# EAGLE schematic Esquema_general (EAGLE 9.1.3)
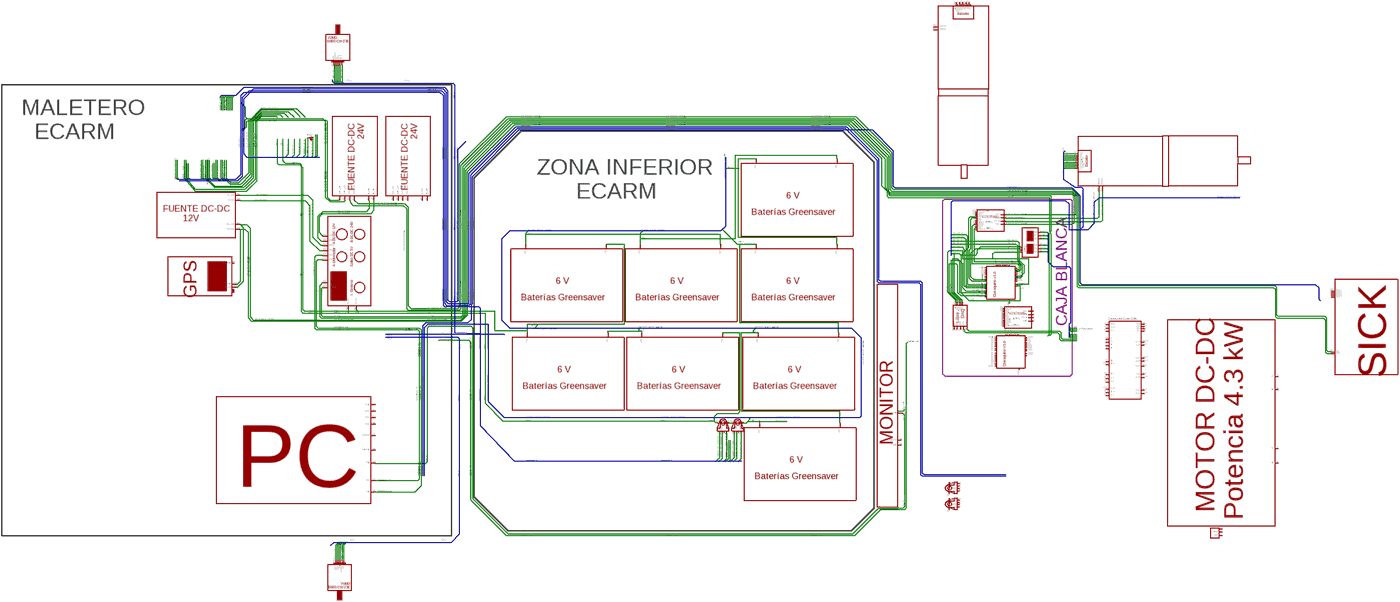
[diagram p0: schematic, sheet 1, overview]
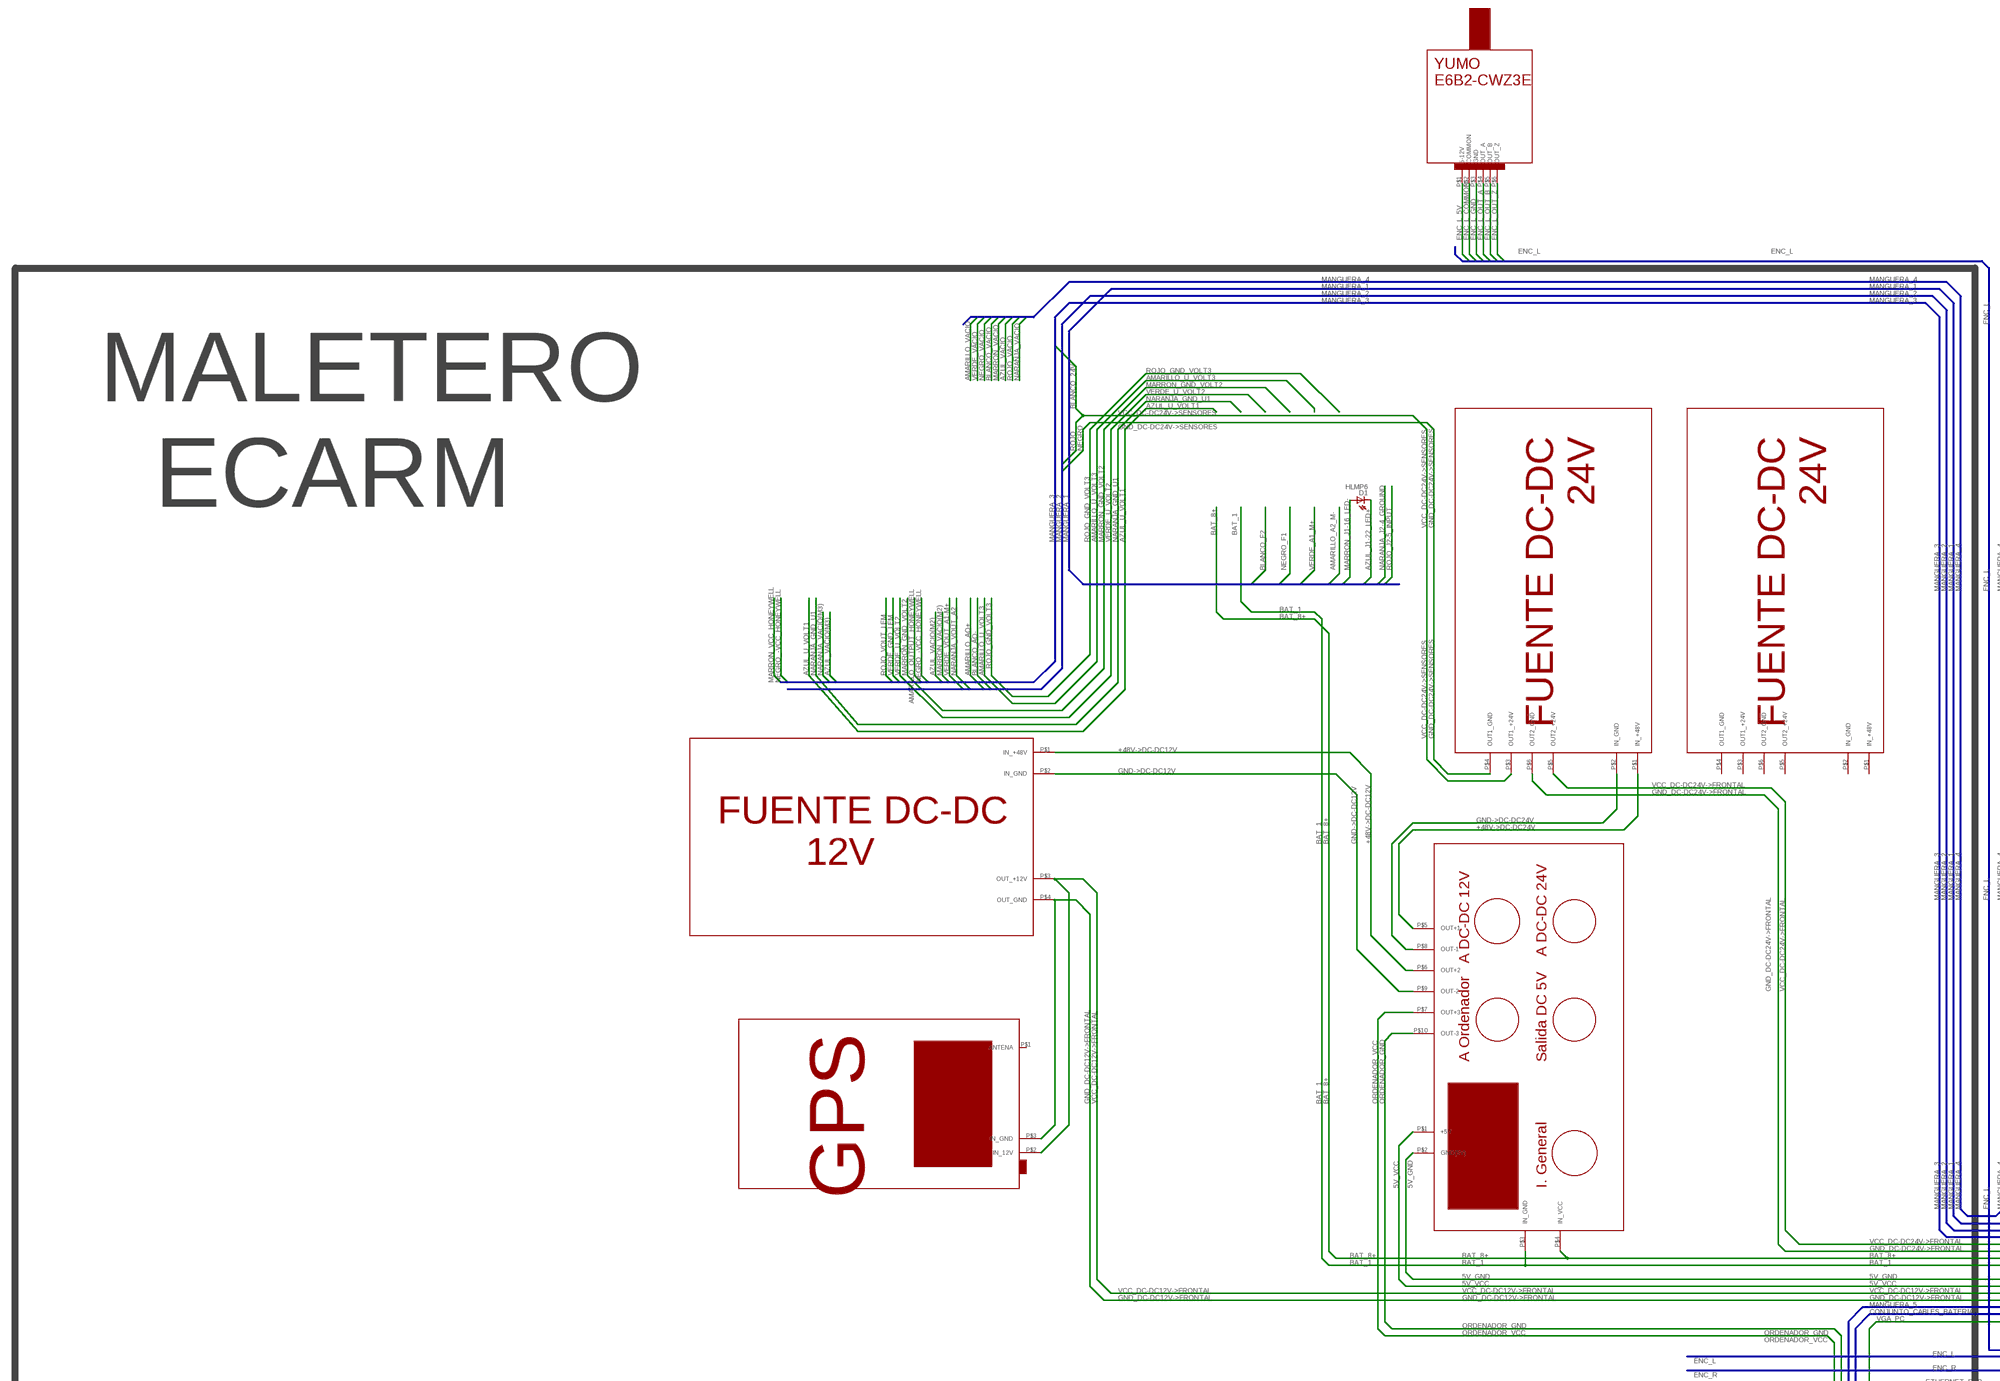
[diagram p1: schematic, sheet 1, part 1 of 6]
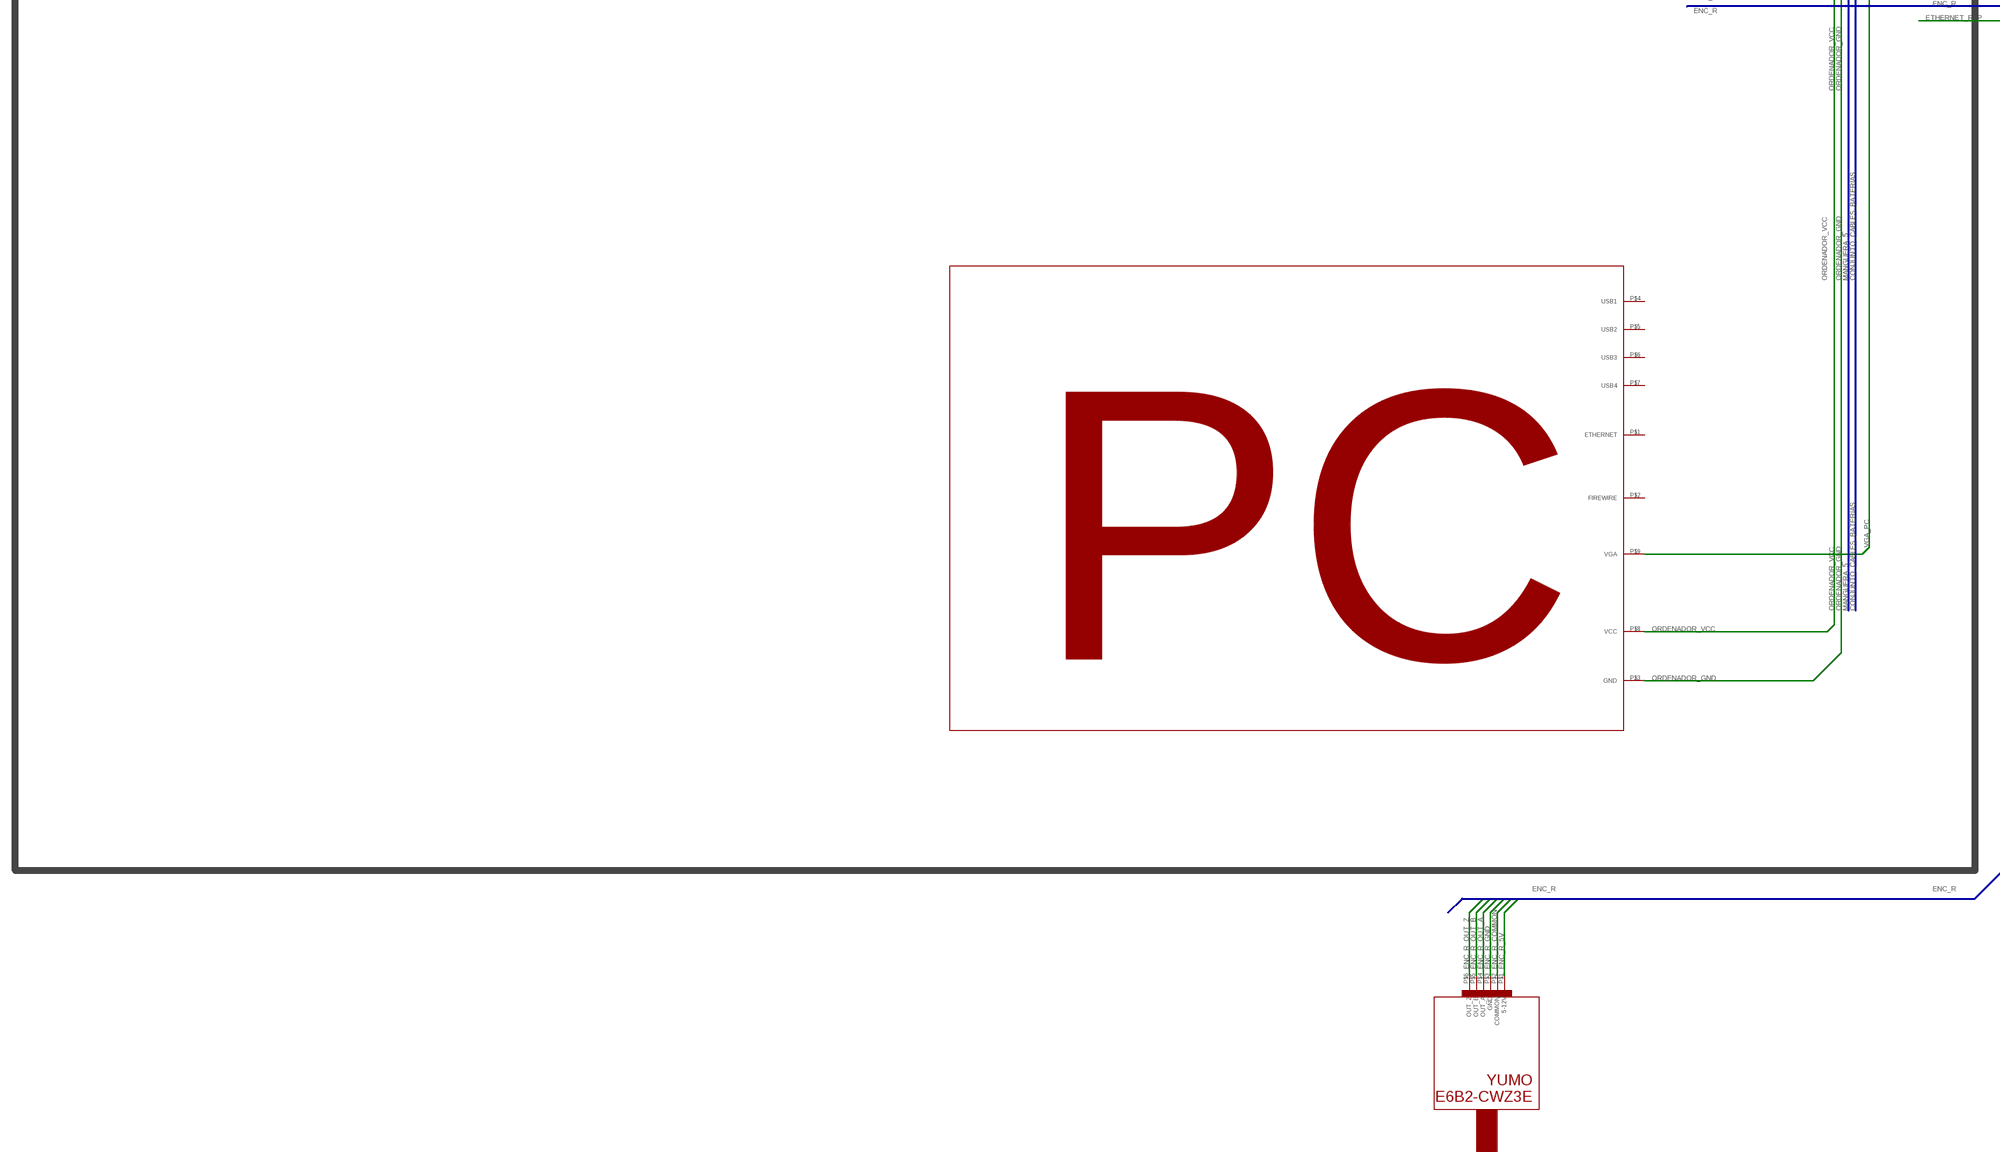
[diagram p2: schematic, sheet 1, part 2 of 6]
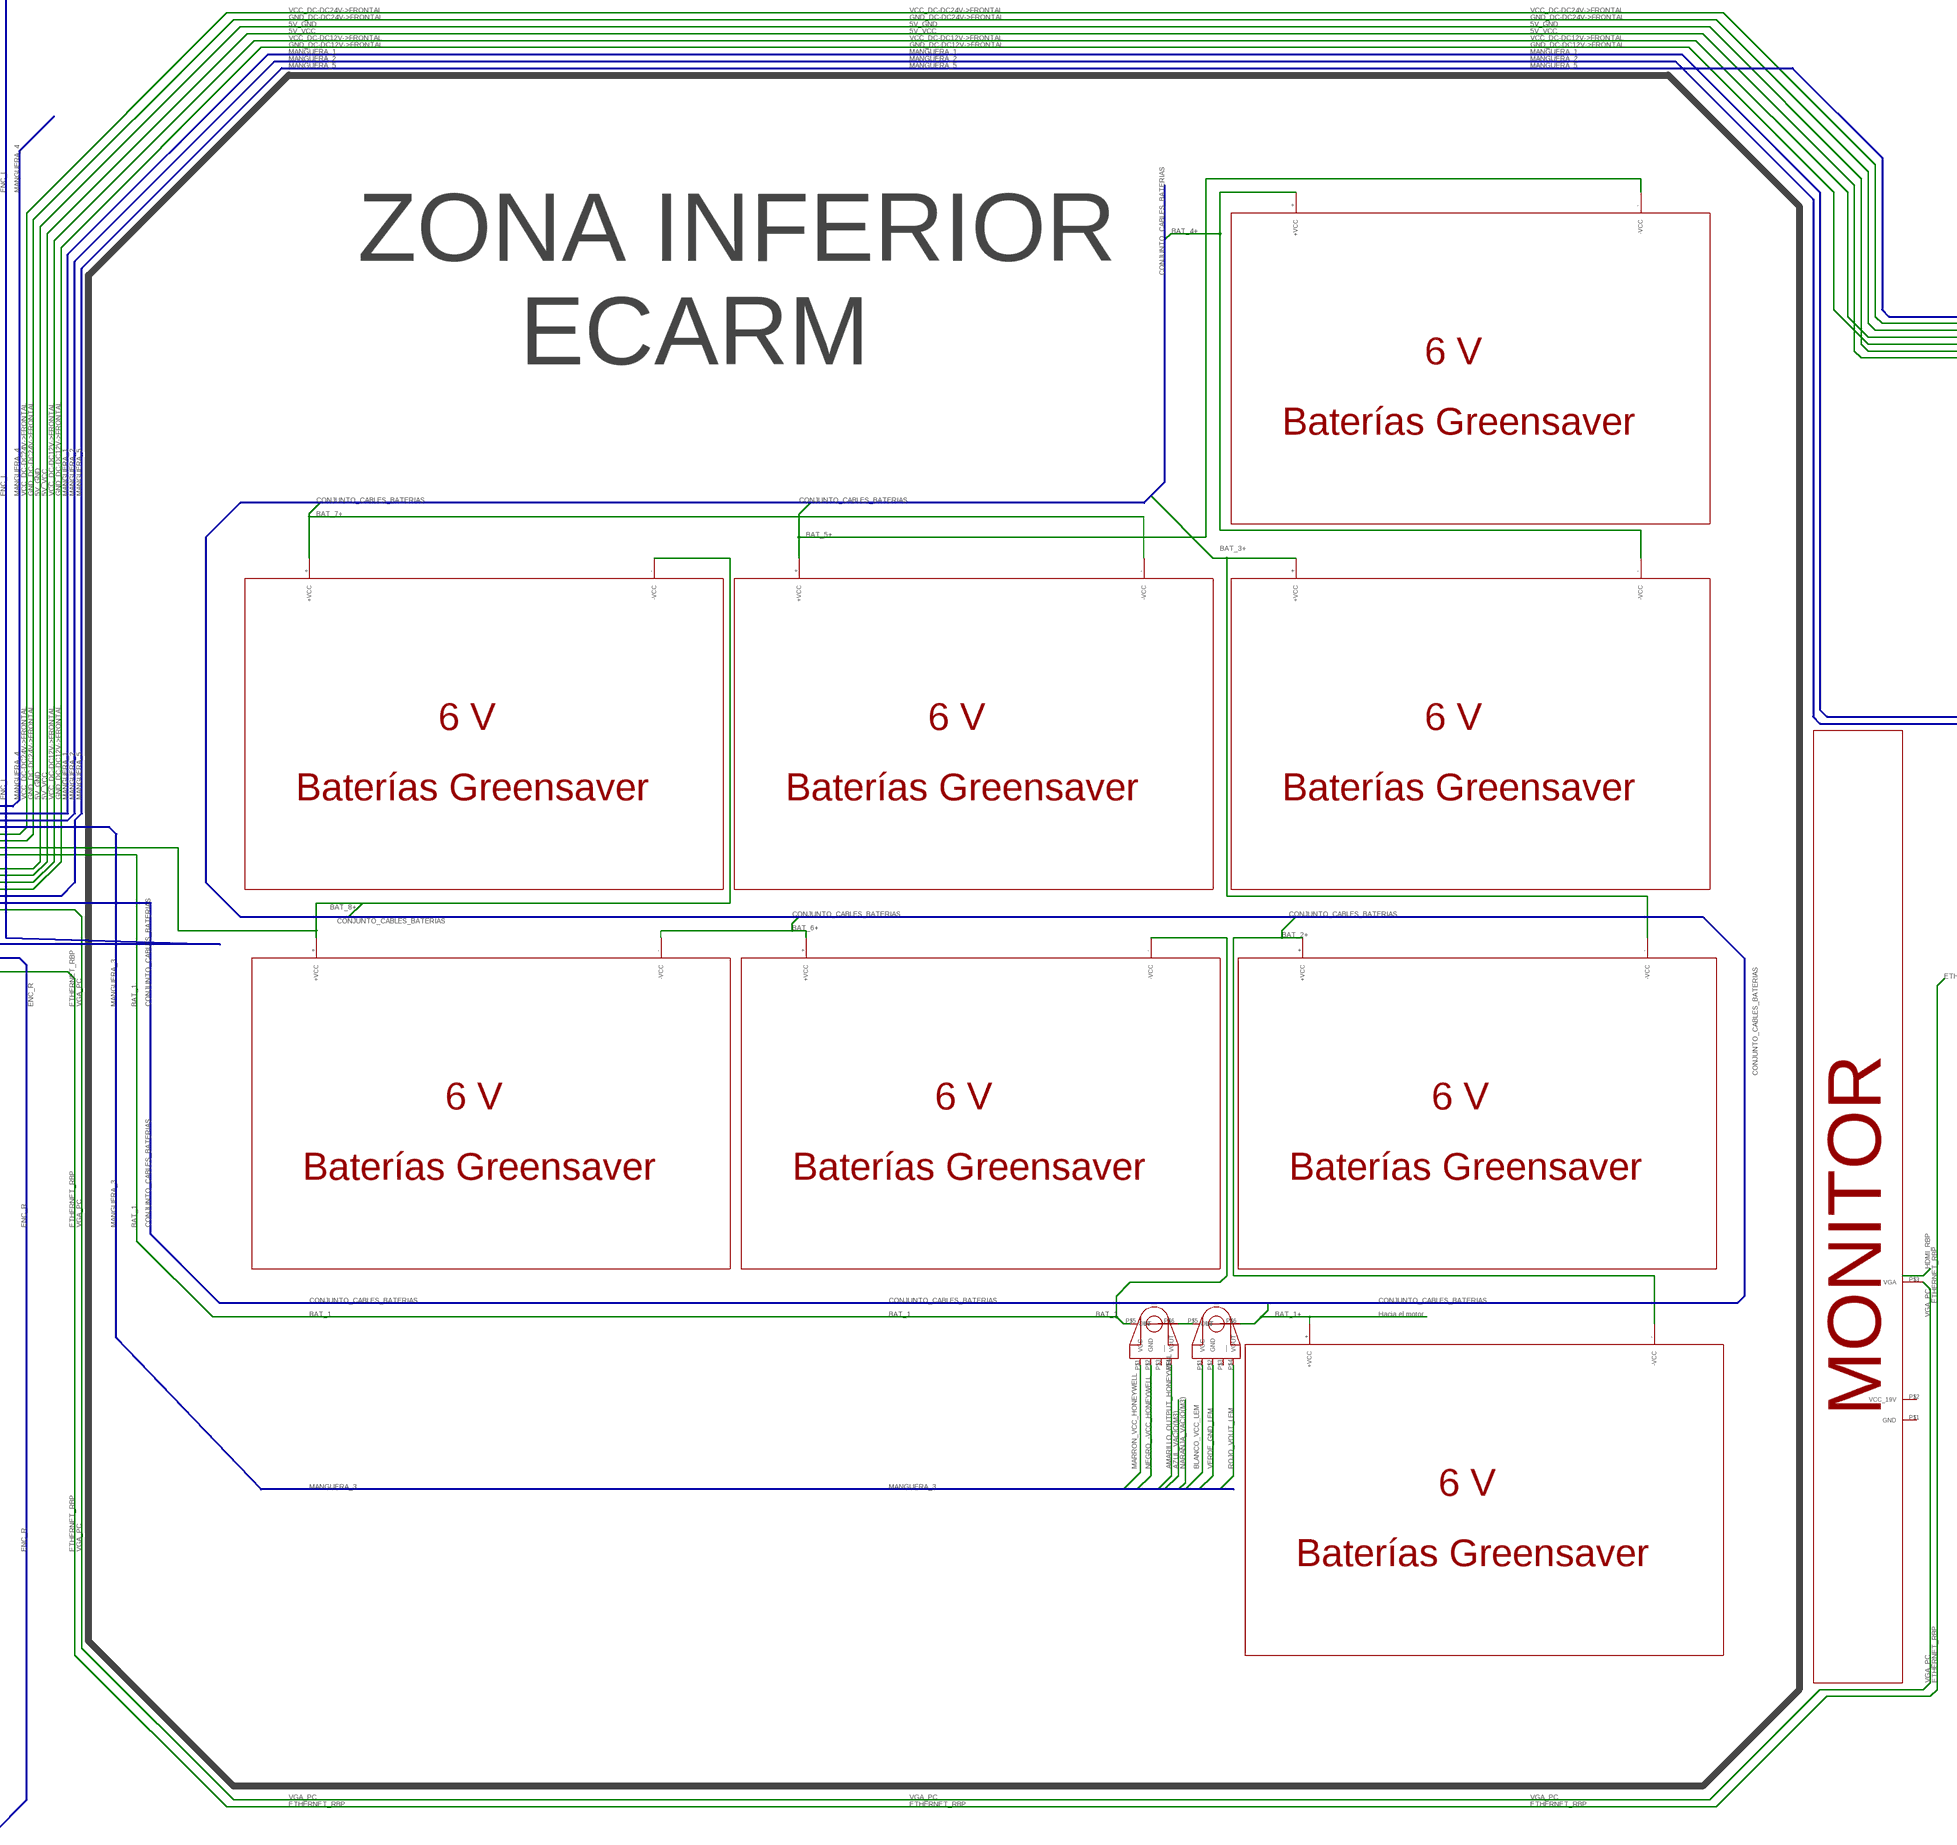
[diagram p3: schematic, sheet 1, part 3 of 6]
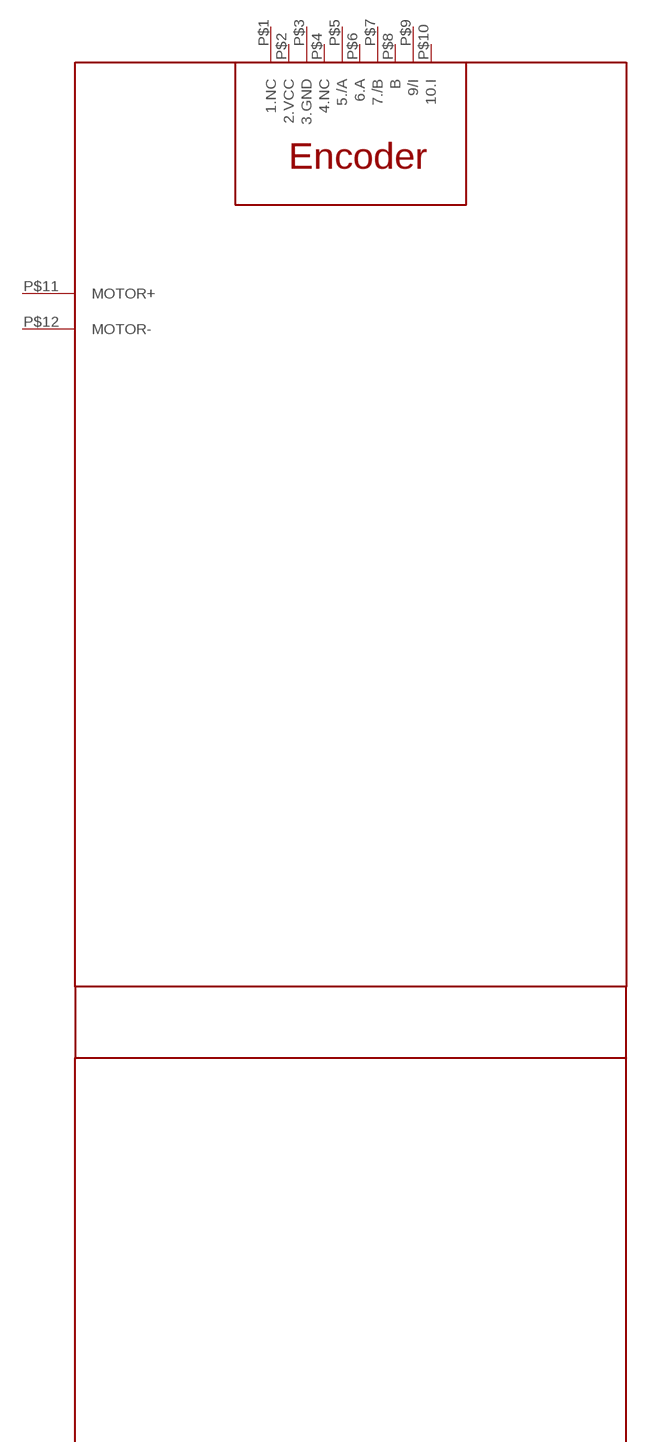
[diagram p4: schematic, sheet 1, part 4 of 6]
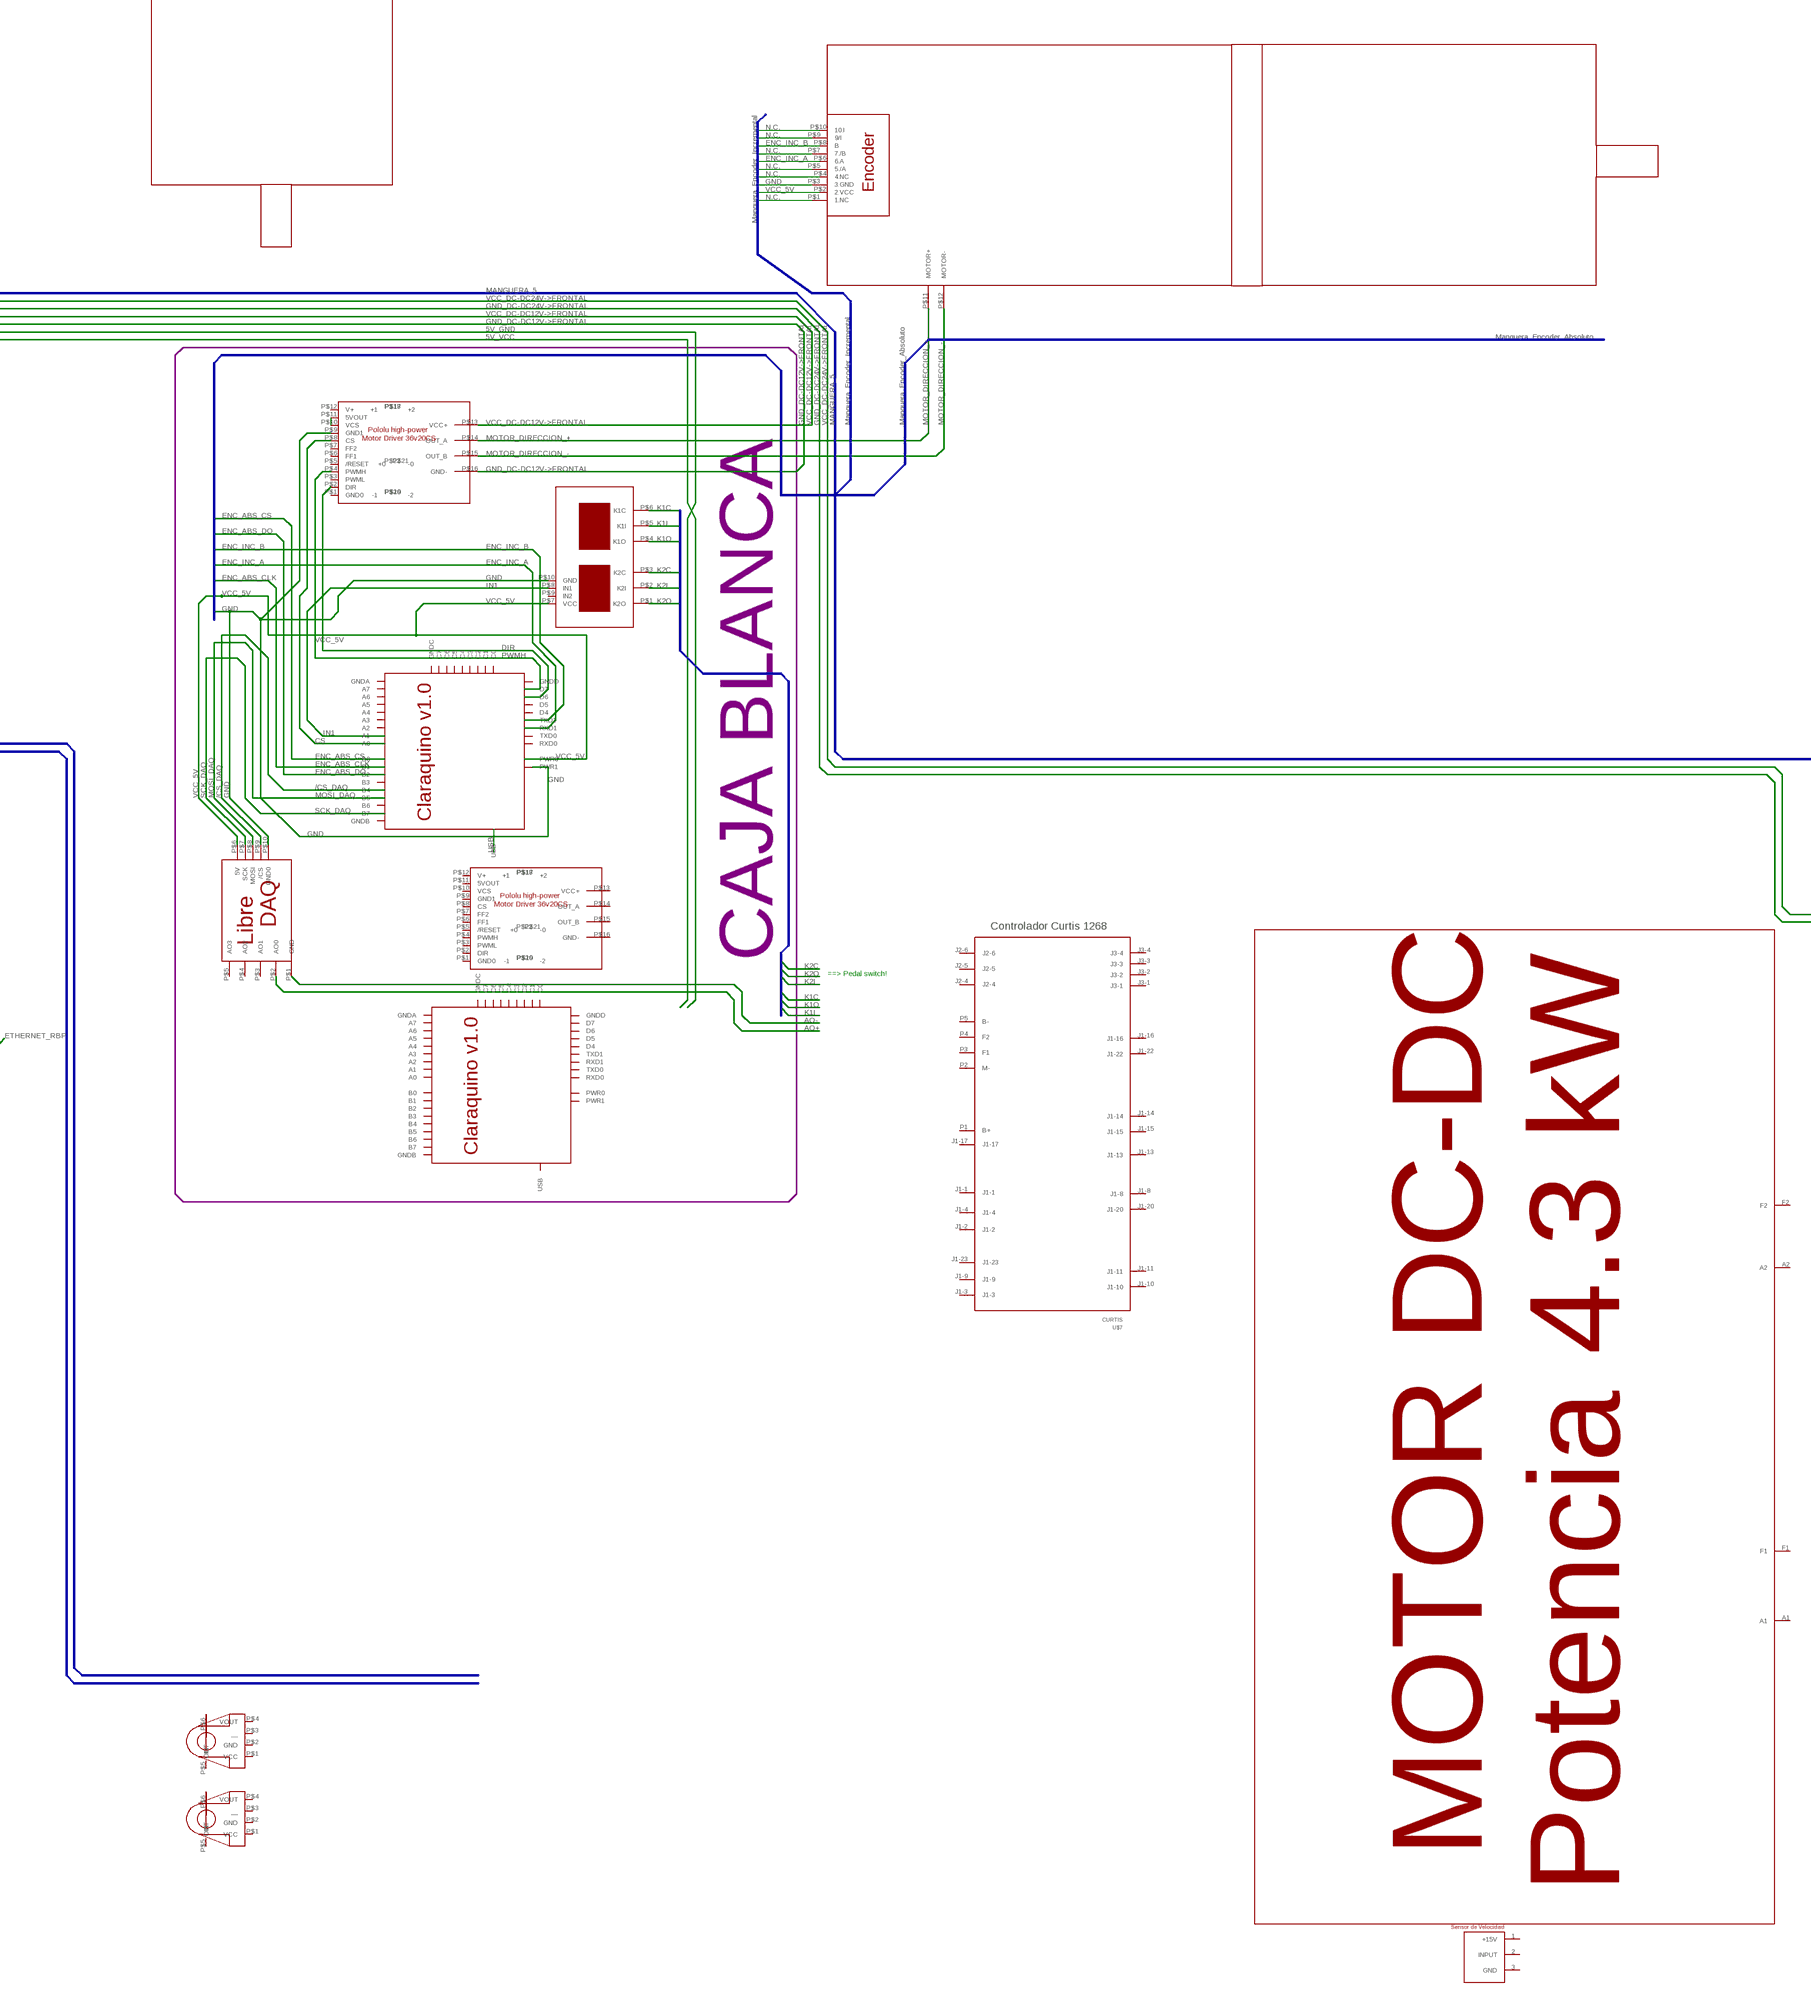
[diagram p5: schematic, sheet 1, part 5 of 6]
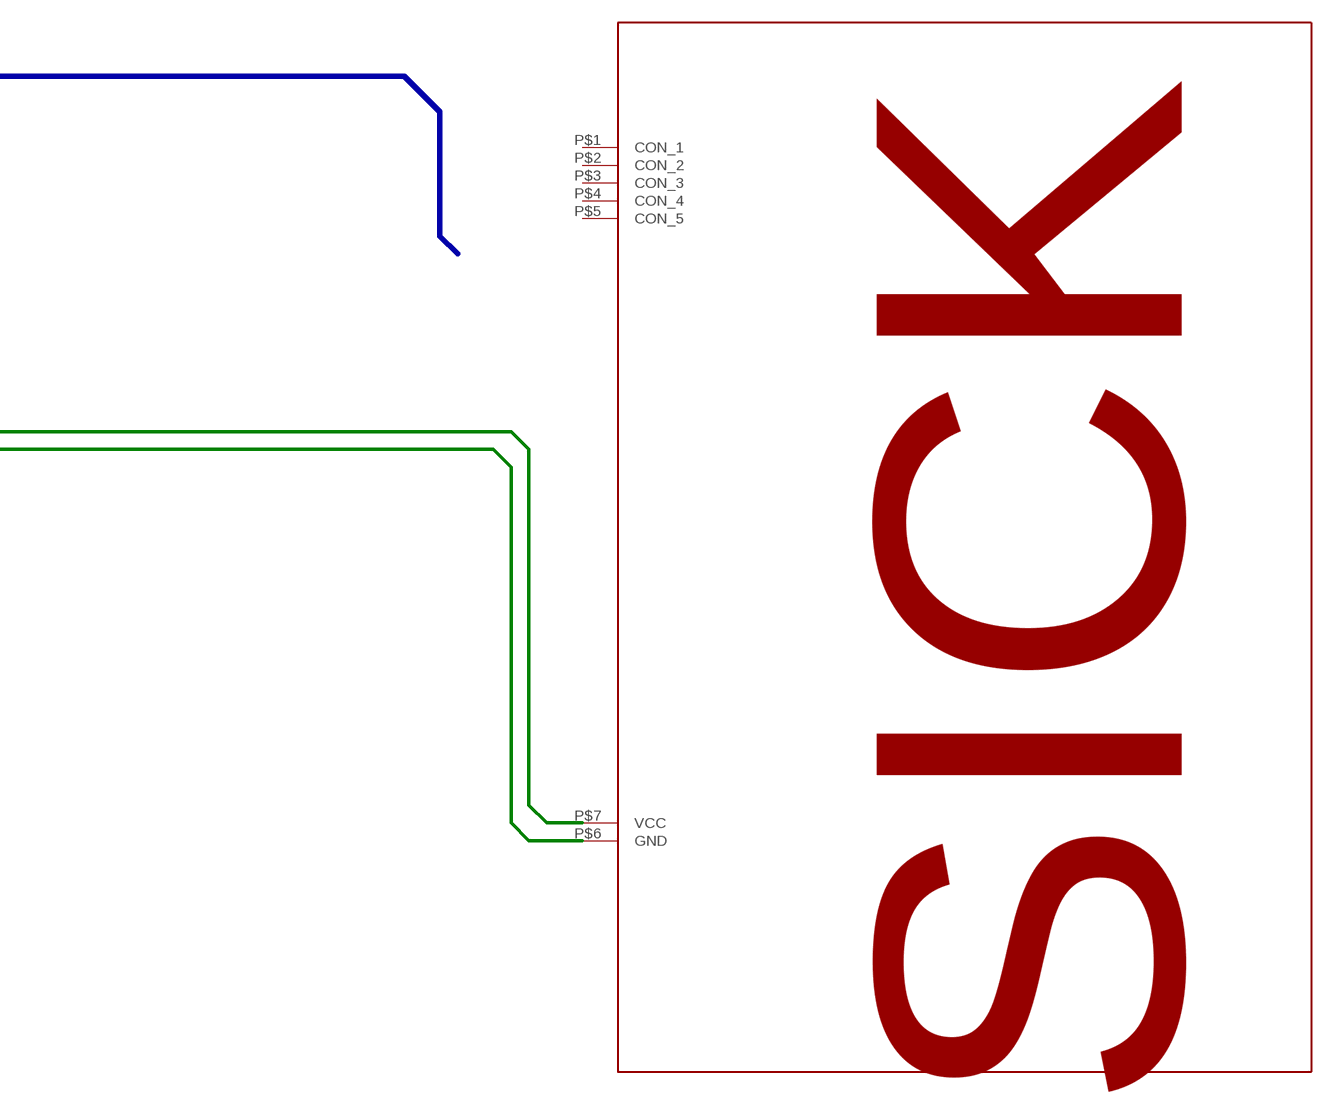
[diagram p6: schematic, sheet 1, part 6 of 6]

## Parts
D1  HLMP6  [HLMP6]
U$1  CLARAQUINO_V1.0  (no package)
U$2  FUENTE_24V  [FUENTE_24V]
U$3  SENSOR_VELOCIDAD  [SENSOR_VEL]
U$7  CURTIS  [CURTIS]
U$8  BATERIA  [BATERIA]
U$9  BATERIA  [BATERIA]
U$10  BATERIA  [BATERIA]
U$11  BATERIA  [BATERIA]
U$12  BATERIA  [BATERIA]
U$13  BATERIA  [BATERIA]
U$14  BATERIA  [BATERIA]
U$15  BATERIA  [BATERIA]
U$16  PC  [PC]
U$17  GPS  [GPS]
U$18  AMPERIMETRO  [AMPERIMETRO]
U$19  AMPERIMETRO  [AMPERIMETRO]
U$20  AMPERIMETRO  [AMPERIMETRO]
U$21  POWERBOX  [POWERBOX]
U$22  FUENTE_12V  [FUENTE_12V]
U$23  FUENTE_24V  [FUENTE_24V]
U$24  CLARAQUINO_V1.0  (no package)
U$26  ENCODER_YUMO  [ENCODER]
U$27  ENCODER_YUMO  [ENCODER]
U$28  MONITOR  [MONITOR]
U$29  SICK  [SICK]
U$30  MOTOR_SENSORES  [MOTOR_SENSORES]
U$31  MOTOR_DIRECCION  [MOTOR_DIRECCION]
U$32  RELE_ARDUINO  [RELE_ARDUINO]
U$33  POLOLU_HIGH-POWER_MOTOR_DRIVER  [POLOLU_HIGH-POWER_MOTOR]
U$34  POLOLU_HIGH-POWER_MOTOR_DRIVER  [POLOLU_HIGH-POWER_MOTOR]
U$35  AMPERIMETRO  [AMPERIMETRO]
U$36  LIBRE_DAQ  [LIBRE_DAQ]
U$37  MOTOR_DIRECCION  [MOTOR_DIRECCION]

## Nets
5V_GND: U$21.P$2(GND(5V))
5V_VCC: U$21.P$1(+5V)
+48V->DC-DC12V: U$21.P$6(OUT+2) U$22.P$1(IN_+48V)
+48V->DC-DC24V: U$21.P$5(OUT+1) U$23.P$1(IN_+48V)
/CS_DAQ: U$24.B4 U$36.P$9(/CS)
AMARILLO_OUTPUT_HONEYWELL: U$35.P$4(VOUT)
AO+: U$36.P$2(AO0)
AO-: U$36.P$1(GND)
AZUL_J1-22_LED+: D1.K
BAT_1: U$9.-(-VCC) U$21.P$3(IN_GND) U$35.P$5(IN)
BAT_1+: U$11.+(+VCC) U$20.P$6(OUT)
BAT_2+: U$10.+(+VCC) U$11.-(-VCC)
BAT_3+: U$10.-(-VCC) U$13.+(+VCC)
BAT_4+: U$13.-(-VCC) U$15.+(+VCC)
BAT_5+: U$8.+(+VCC) U$15.-(-VCC)
BAT_6+: U$9.+(+VCC) U$12.-(-VCC)
BAT_7+: U$8.-(-VCC) U$14.+(+VCC)
BAT_8+: U$12.+(+VCC) U$14.-(-VCC) U$21.P$4(IN_VCC)
BLANCO_VCC_LEM: U$20.P$1(VCC)
CS: U$24.A0 U$34.P$8(CS)
DIR: U$24.D6 U$34.P$2(DIR)
ENC_ABS_CLK: U$24.B1
ENC_ABS_CS: U$24.B0
ENC_ABS_DO: U$24.B2
ENC_INC_A: U$24.RXD1 U$37.P$6(6.A)
ENC_INC_B: U$24.TXD1 U$37.P$8(B)
ENC_L_5V: U$26.P$1(5-12V)
ENC_L_COMMON: U$26.P$2(COMMON)
ENC_L_GND: U$26.P$3(GND)
ENC_L_OUT_A: U$26.P$4(OUT_A)
ENC_L_OUT_B: U$26.P$5(OUT_B)
ENC_L_OUT_Z: U$26.P$6(OUT_Z)
ENC_R_5V: U$27.P$1(5-12V)
ENC_R_COMMON: U$27.P$2(COMMON)
ENC_R_GND: U$27.P$3(GND)
ENC_R_OUT_A: U$27.P$4(OUT_A)
ENC_R_OUT_B: U$27.P$5(OUT_B)
ENC_R_OUT_Z: U$27.P$6(OUT_Z)
GND: U$32.P$10(GND) U$34.P$9(GND1) U$36.P$10(GND0) U$37.P$3(3.GND)
GND->DC-DC12V: U$21.P$9(OUT-2) U$22.P$2(IN_GND)
GND->DC-DC24V: U$21.P$8(OUT-1) U$23.P$2(IN_GND)
GND_DC-DC12V->FRONTAL: U$17.P$3(IN_GND) U$22.P$4(OUT_GND) U$34.P$16(GND-)
GND_DC-DC24V->FRONTAL: U$23.P$6(OUT2_GND) U$29.P$6(GND)
GND_DC-DC24V->SENSORES: U$23.P$4(OUT1_GND)
IN1: U$24.A1 U$32.P$8(IN1)
K1C: U$32.P$6(K1C)
K1I: U$32.P$5(K1I)
K1O: U$32.P$4(K1O)
K2C: U$32.P$3(K2C)
K2I: U$32.P$2(K2I)
K2O: U$32.P$1(K2O)
MARRON_J1-16_LED-: D1.A
MARRON_VCC_HONEYWELL: U$35.P$1(VCC)
MOSI_DAQ: U$24.B5 U$36.P$8(MOSI)
MOTOR_DIRECCION_+: U$34.P$14(OUT_A) U$37.P$11(MOTOR+)
MOTOR_DIRECCION_-: U$34.P$15(OUT_B) U$37.P$12(MOTOR-)
N$2: U$20.P$5(IN) U$35.P$6(OUT)
N$3: U$34.P$10(VCS) U$34.P$11(5VOUT)
N.C.: U$37.P$1(1.NC) U$37.P$4(4.NC) U$37.P$5(5./A) U$37.P$7(7./B) U$37.P$9(9/I) U$37.P$10(10.I)
NEGRO_-VCC_HONEYWELL: U$35.P$2(GND)
ORDENADOR_GND: U$16.P$3(GND) U$21.P$10(OUT-3)
ORDENADOR_VCC: U$16.P$8(VCC) U$21.P$7(OUT+3)
PWMH: U$24.D7 U$34.P$4(PWMH)
ROJO_VOUT_LEM: U$20.P$4(VOUT)
SCK_DAQ: U$24.B7 U$36.P$7(SCK)
USB: U$24.USB
VCC_5V: U$24.PWR0 U$32.P$7(VCC) U$36.P$6(5V) U$37.P$2(2.VCC)
VCC_DC-DC12V->FRONTAL: U$17.P$2(IN_12V) U$22.P$3(OUT_+12V) U$34.P$13(VCC+)
VCC_DC-DC24V->FRONTAL: U$23.P$5(OUT2_+24V) U$29.P$7(VCC)
VCC_DC-DC24V->SENSORES: U$23.P$3(OUT1_+24V)
VERDE_GND_LEM: U$20.P$2(GND)
VGA_PC: U$16.P$9(VGA) U$28.P$3(VGA)
Unconnected: U$1.A0 U$1.A1 U$1.A2 U$1.A3 U$1.A4 U$1.A5 U$1.A6 U$1.A7 U$1.B0 U$1.B1 U$1.B2 U$1.B3 U$1.B4 U$1.B5 U$1.B6 U$1.B7 U$1.C0 U$1.C1 U$1.C2 U$1.C3 U$1.C4 U$1.C5 U$1.C6 U$1.C7 U$1.D4 U$1.D5 U$1.D6 U$1.D7 U$1.GNDA U$1.GNDB U$1.GNDC U$1.GNDD U$1.PWR0 U$1.PWR1 U$1.RXD0 U$1.RXD1 U$1.TXD0 U$1.TXD1 U$1.USB U$2.P$1(IN_+48V) U$2.P$2(IN_GND) U$2.P$3(OUT1_+24V) U$2.P$4(OUT1_GND) U$2.P$5(OUT2_+24V) U$2.P$6(OUT2_GND) U$3.1(+15V) U$3.2(INPUT) U$3.3(GND) U$7.J1-1 U$7.J1-2 U$7.J1-3 U$7.J1-4 U$7.J1-8 U$7.J1-9 U$7.J1-10 U$7.J1-11 U$7.J1-13 U$7.J1-14 U$7.J1-15 U$7.J1-16 U$7.J1-17 U$7.J1-20 U$7.J1-22 U$7.J1-23 U$7.J2-4 U$7.J2-5 U$7.J2-6 U$7.J3-1 U$7.J3-2 U$7.J3-3 U$7.J3-4 U$7.P1(B+) U$7.P2(M-) U$7.P3(F1) U$7.P4(F2) U$7.P5(B-) U$16.P$1(ETHERNET) U$16.P$2(FIREWIRE) U$16.P$4(USB1) U$16.P$5(USB2) U$16.P$6(USB3) U$16.P$7(USB4) U$17.P$1(ANTENA) U$18.P$1(VCC) U$18.P$2(GND) U$18.P$3(__) U$18.P$4(VOUT) U$18.P$5(IN) U$18.P$6(OUT) U$19.P$1(VCC) U$19.P$2(GND) U$19.P$3(__) U$19.P$4(VOUT) U$19.P$5(IN) U$19.P$6(OUT) U$20.P$3(__) U$24.A2 U$24.A3 U$24.A4 U$24.A5 U$24.A6 U$24.A7 U$24.B3 U$24.B6 U$24.C0 U$24.C1 U$24.C2 U$24.C3 U$24.C4 U$24.C5 U$24.C6 U$24.C7 U$24.D4 U$24.D5 U$24.GNDA U$24.GNDB U$24.GNDC U$24.GNDD U$24.PWR1 U$24.RXD0 U$24.TXD0 U$28.P$1(GND) U$28.P$2(VCC_19V) U$29.P$1(CON_1) U$29.P$2(CON_2) U$29.P$3(CON_3) U$29.P$4(CON_4) U$29.P$5(CON_5) U$30.A1 U$30.A2 U$30.F1 U$30.F2 U$31.P$1(1.NC) U$31.P$2(2.VCC) U$31.P$3(3.GND) U$31.P$4(4.NC) U$31.P$5(5./A) U$31.P$6(6.A) U$31.P$7(7./B) U$31.P$8(B) U$31.P$9(9/I) U$31.P$10(10.I) U$31.P$11(MOTOR+) U$31.P$12(MOTOR-) U$32.P$9(IN2) U$33.P$1(GND0) U$33.P$2(DIR) U$33.P$3(PWML) U$33.P$4(PWMH) U$33.P$5(/RESET) U$33.P$6(FF1) U$33.P$7(FF2) U$33.P$8(CS) U$33.P$9(GND1) U$33.P$10(VCS) U$33.P$11(5VOUT) U$33.P$12(V+) U$33.P$13(VCC+) U$33.P$14(OUT_A) U$33.P$15(OUT_B) U$33.P$16(GND-) U$33.P$17(+1) U$33.P$18(+2) U$33.P$19(-1) U$33.P$20(-2) U$33.P$21(+0) U$33.P$22(-0) U$34.P$1(GND0) U$34.P$3(PWML) U$34.P$5(/RESET) U$34.P$6(FF1) U$34.P$7(FF2) U$34.P$12(V+) U$34.P$17(+1) U$34.P$18(+2) U$34.P$19(-1) U$34.P$20(-2) U$34.P$21(+0) U$34.P$22(-0) U$35.P$3(__) U$36.P$3(AO1) U$36.P$4(AO2) U$36.P$5(AO3)

## Buses
CONJUNTO_CABLES_BATERIAS
MANGUERA_3
ENC_L
ENC_R
MANGUERA_2
MANGUERA_1
MANGUERA_4
MANGUERA_5
B$2
B$3

## Notes on the sheet
- BLANCO_24V
- ROJO | NEGRO
- MALETERO 
    ECARM
- Manguera_Encoder_Incremental
- Manguera_Encoder_Absoluto
- ZONA INFERIOR
        ECARM
- Manguera_Encoder_Incremental | Manguera_Encoder_Absoluto
- A DC-DC 24V
- A DC-DC 12V
- A Ordenador | Salida DC 5V
- I. General
- CAJA BLANCA
- ==> Pedal switch!
- Hacia el motor

## Library data of the parts
D1 = display-hp:HLMP6: LED 2mm horizontal; MF: AGILENT TECHNOLOGIES; MPN: HLMP-6500; OC_FARNELL: 1652490; OC_NEWARK: 40K0088
U$1 U$24 = ecar:CLARAQUINO_V1.0
U$2 U$23 = ecar:FUENTE_24V
U$3 = ecar:SENSOR_VELOCIDAD
U$7 = ecar:CURTIS
U$8-U$15 = ecar:BATERIA
U$16 = ecar:PC
U$17 = ecar:GPS
U$18-U$20 U$35 = ecar:AMPERIMETRO
U$21 = ecar:POWERBOX
U$22 = ecar:FUENTE_12V
U$26 U$27 = ecar:ENCODER_YUMO
U$28 = ecar:MONITOR
U$29 = ecar:SICK
U$30 = ecar:MOTOR_SENSORES
U$31 U$37 = ecar:MOTOR_DIRECCION
U$32 = ecar:RELE_ARDUINO
U$33 U$34 = ecar:POLOLU_HIGH-POWER_MOTOR_DRIVER
U$36 = ecar:LIBRE_DAQ